# Altium project LimePSB-RPCM_1v3.PrjPcb (part 6 of 14)

## Sheet 09_USB_hub.SchDoc: USB 2.0 hub
size A3; Organization: Lime Microsystems; Address1: Surrey Tech Centre; Address2: Guildford GU2 7YG; Address3: Surrey; Address4: United Kingdom; Revision: v1.3; SheetNumber: 9; SheetTotal: 15
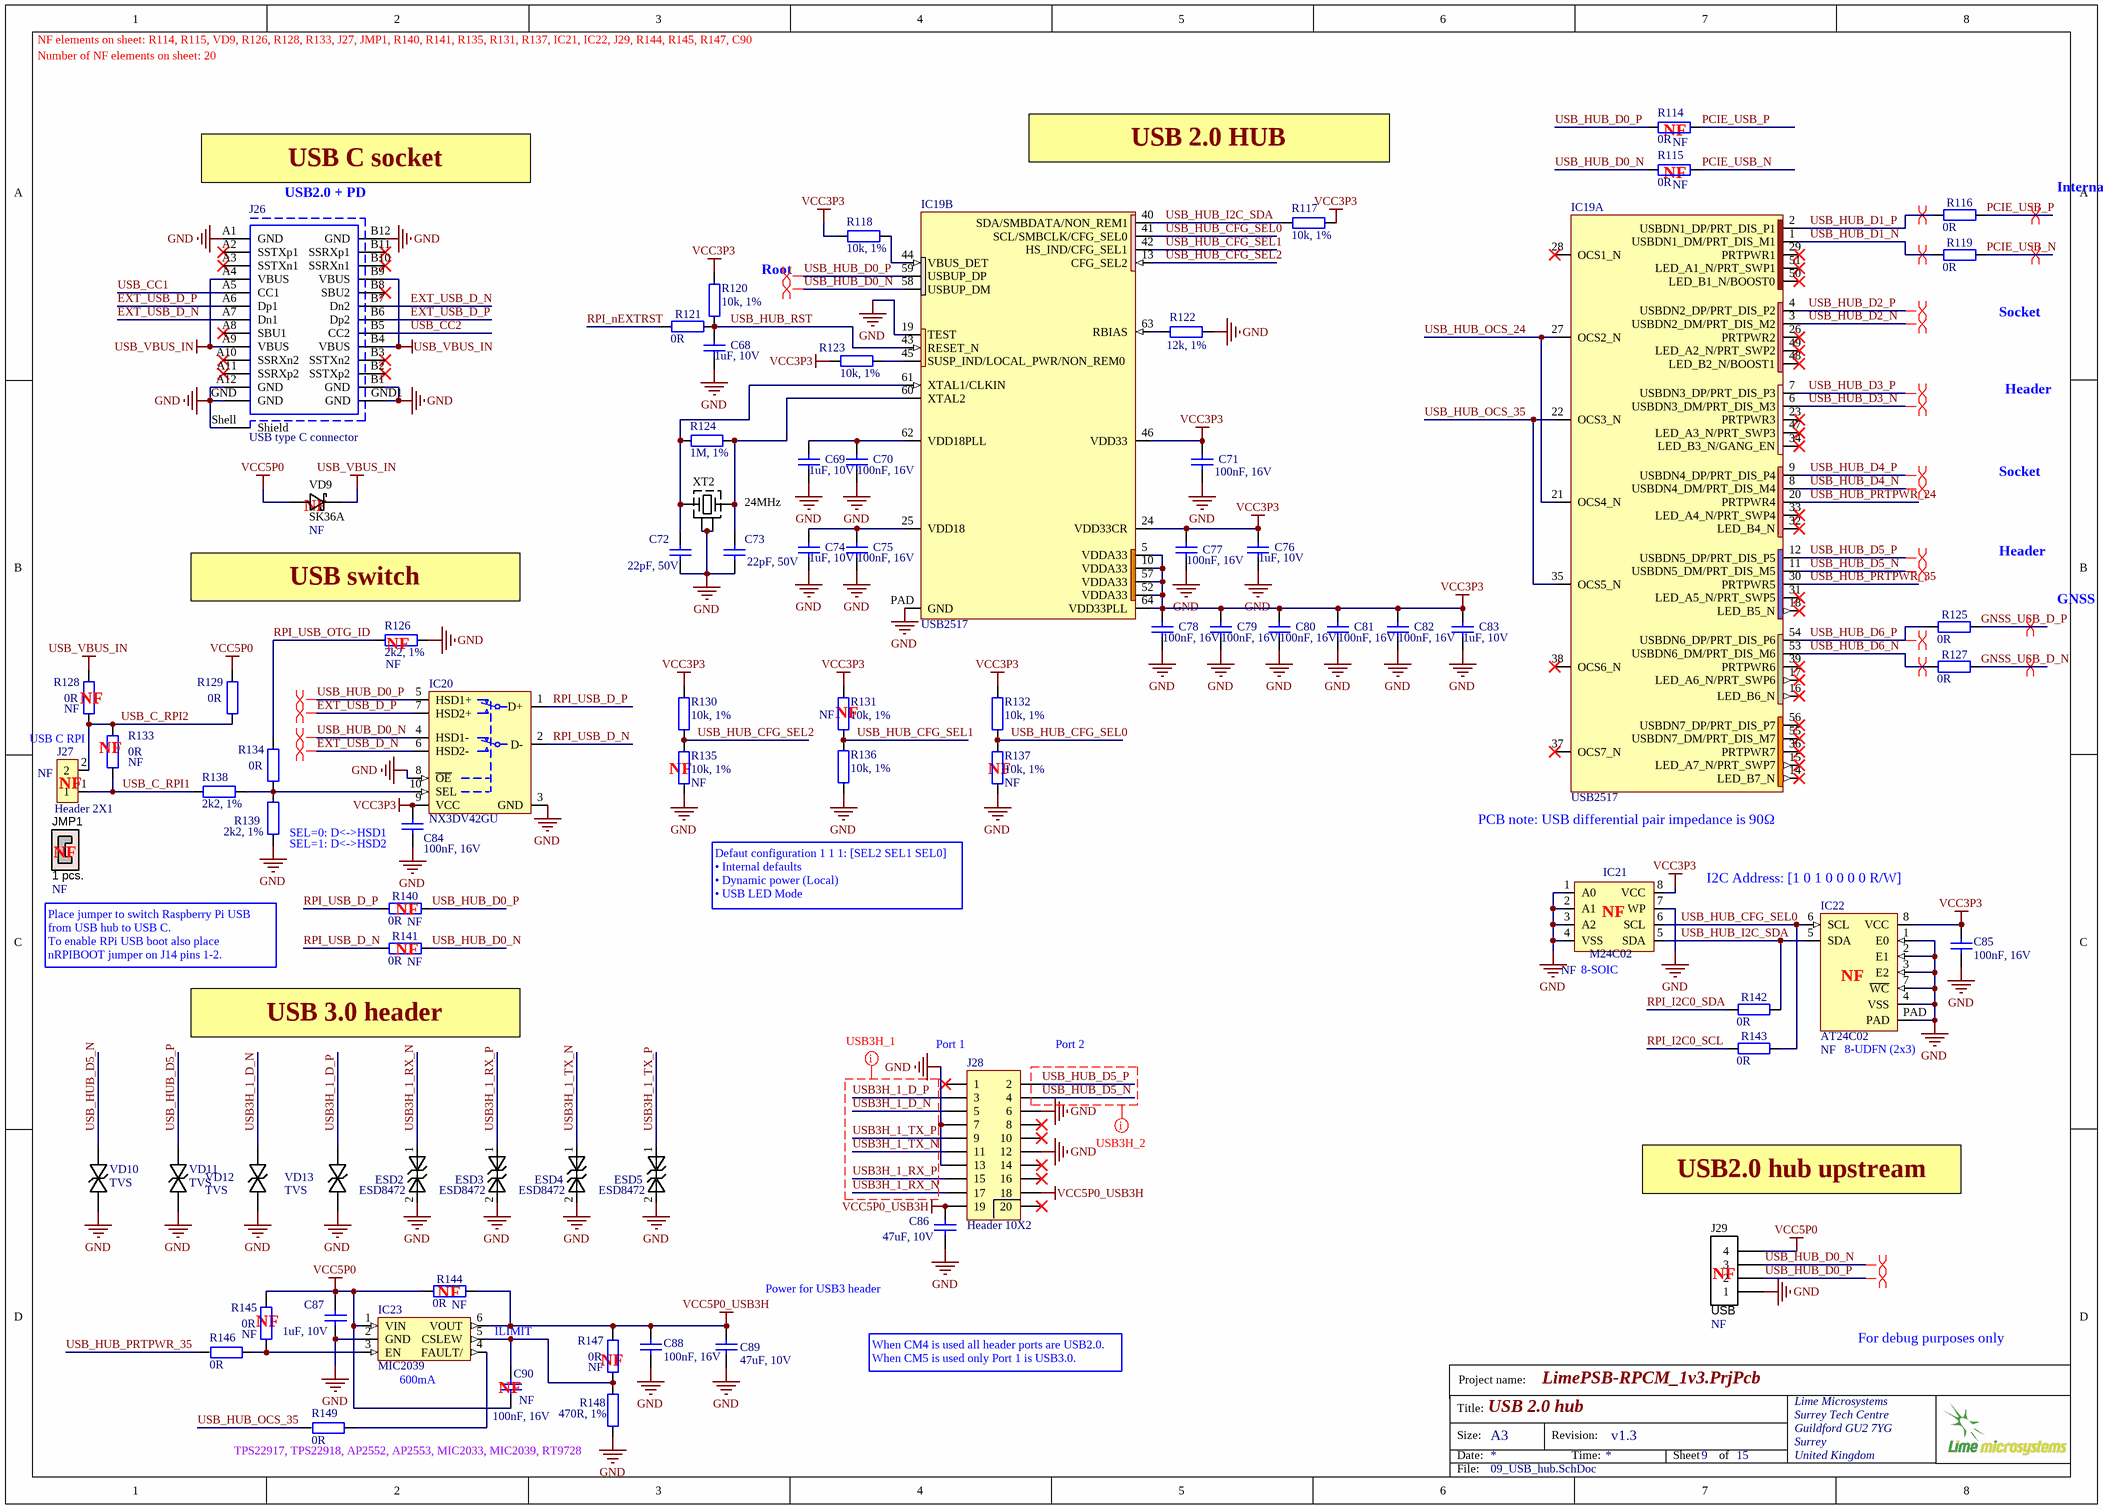
[diagram p8: 09_USB_hub.SchDoc]

### Parts
C68  1uF, 10V  [CAP0402]
C69  1uF, 10V  [CAP0402]
C70  100nF, 16V  [CAP0402]
C71  100nF, 16V  [CAP0402]
C72  22pF, 50V  [CAP0402]
C73  22pF, 50V  [CAP0402]
C74  1uF, 10V  [CAP0402]
C75  100nF, 16V  [CAP0402]
C76  1uF, 10V  [CAP0402]
C77  100nF, 16V  [CAP0402]
C78  100nF, 16V  [CAP0402]
C79  100nF, 16V  [CAP0402]
C80  100nF, 16V  [CAP0402]
C81  100nF, 16V  [CAP0402]
C82  100nF, 16V  [CAP0402]
C83  1uF, 10V  [CAP0402]
C84  100nF, 16V  [CAP0402]
C85  100nF, 16V  [CAP0402]
C86  47uF, 10V  [CAP1206]
C87  1uF, 10V  [CAP0402]
C88  100nF, 16V  [CAP0402]
C89  47uF, 10V  [CAP1206]
C90  100nF, 16V  Assembly Info: NF  [CAP0402]
ESD2  ESD8472  [ESD8472_X3DFN2]
ESD3  ESD8472  [ESD8472_X3DFN2]
ESD4  ESD8472  [ESD8472_X3DFN2]
ESD5  ESD8472  [ESD8472_X3DFN2]
IC19  USB2517  [USB2517-JZX-TR_USB_HUB_QFN64]  (parts A,B of 2)
IC20  NX3DV42GU  [FSUSB42UMX]
IC21  M24C02  Assembly Info: NF  [SOIC127P600-8DL_v2]
IC22  AT24C02  Assembly Info: NF  [M24128-DFMC6TG]
IC23  MIC2039  [SOT23-6]
J26  USB type C connector  [DUAL_USB-C_632723100011]
J27  Header 2X1  Assembly Info: NF  [HDR_1x2]
J28  Header 10X2  [Header10x2_TH_2MM]
J29  USB  Assembly Info: NF  [HEADER4X1_TH]
JMP1  1 pcs.  Assembly Info: NF  (mechanical)
R114  0R  Assembly Info: NF  [RES0402]
R115  0R  Assembly Info: NF  [RES0402]
R116  0R  [RES0402]
R117  10k, 1%  [RES0402]
R118  10k, 1%  [RES0402]
R119  0R  [RES0402]
R120  10k, 1%  [RES0402]
R121  0R  [RES0402]
R122  12k, 1%  [RES0402]
R123  10k, 1%  [RES0402]
R124  1M, 1%  [RES0402]
R125  0R  [RES0402]
R126  2k2, 1%  Assembly Info: NF  [RES0402]
R127  0R  [RES0402]
R128  0R  Assembly Info: NF  [RES0402]
R129  0R  [RES0402]
R130  10k, 1%  [RES0402]
R131  10k, 1%  Assembly Info: NF  [RES0402]
R132  10k, 1%  [RES0402]
R133  0R  Assembly Info: NF  [RES0402]
R134  0R  [RES0402]
R135  10k, 1%  Assembly Info: NF  [RES0402]
R136  10k, 1%  [RES0402]
R137  10k, 1%  Assembly Info: NF  [RES0402]
R138  2k2, 1%  [RES0402]
R139  2k2, 1%  [RES0402]
R140  0R  Assembly Info: NF  [RES0402]
R141  0R  Assembly Info: NF  [RES0402]
R142  0R  [RES0402]
R143  0R  [RES0402]
R144  0R  Assembly Info: NF  [RES0402]
R145  0R  Assembly Info: NF  [RES0402]
R146  0R  [RES0402]
R147  0R  Assembly Info: NF  [RES0402]
R148  470R, 1%  [RES0402]
R149  0R  [RES0402]
VD9  SK36A  Assembly Info: NF  [SK32A-L_DIODE_DO-214AC]
VD10  TVS  [SOD323]
VD11  TVS  [SOD323]
VD12  TVS  [SOD323]
VD13  TVS  [SOD323]
XT2  24MHz  [CRYSTAL_4-LCC]

### Nets
GND: C68.1 C69.1 C70.2 C71.2 C72.1 C73.1 C74.1 C75.2 C76.1 C77.2 C78.2 C79.2 C80.2 C81.2 C82.2 C83.1 C84.2 C85.2 C86.1 C87.2 C88.2 C89.1 ESD2.2 ESD3.2 ESD4.2 ESD5.2 IC19.19(TEST) IC19.PAD(GND) IC20.3(GND) IC20.8(~{OE}) IC21.1(A0) IC21.2(A1) IC21.3(A2) IC21.4(VSS) IC21.7(WP) IC22.1(E0) IC22.2(E1) IC22.3(E2) IC22.4(VSS) IC22.7(~{WC}) IC22.PAD IC23.2(GND) J26.A1(GND) J26.A12(GND) J26.B1(GND) J26.B12(GND) J26.GND J26.GND1(GND) J26.Shell(Shield) J28.6 J28.7 J28.12 J28.13 J29.1 R122.2 R126.2 R135.1 R136.2 R137.1 R139.2 R148.1 VD10.K VD11.K VD12.K VD13.K XT2.2(GND) XT2.4(GND)
USB_VBUS_IN: J26.A4(VBUS) J26.A9(VBUS) J26.B4(VBUS) J26.B9(VBUS) R128.2 VD9.K
VCC3P3: C71.1 C76.2 C77.1 C78.1 C79.1 C80.1 C81.1 C82.1 C83.2 C84.1 C85.1 IC19.5(VDDA33) IC19.10(VDDA33) IC19.24(VDD33CR) IC19.46(VDD33) IC19.52(VDDA33) IC19.57(VDDA33) IC19.64(VDD33PLL) IC20.9(VCC) IC21.8(VCC) IC22.8(VCC) R117.2 R118.1 R120.2 R123.2 R130.2 R131.2 R132.2
VCC5P0: C87.1 C90.2 IC23.1(VIN) J29.4 R129.2 R144.2 R145.2 VD9.A
VCC5P0_USB3H: C86.2 C88.1 C89.2 IC23.6(VOUT) J28.18 J28.19 R144.1 R147.2
EXT_USB_D_N: IC20.6(HSD2-) J26.A7(Dn1) J26.B7(Dn2)
EXT_USB_D_P: IC20.7(HSD2+) J26.A6(Dp1) J26.B6(Dp2)
GNSS_USB_D_N: R127.1
GNSS_USB_D_P: R125.1
PCIE_USB_N: R115.2 R119.1
PCIE_USB_P: R114.2 R116.1
RPI_I2C0_SCL: R143.2
RPI_I2C0_SDA: R142.2
RPI_nEXTRST: R121.2
RPI_USB_D_N: IC20.2(D-) R141.2
RPI_USB_D_P: IC20.1(D+) R140.2
RPI_USB_OTG_ID: R126.1 R134.2
USB3H_1_D_N: J28.5 VD12.A
USB3H_1_D_P: J28.3 VD13.A
USB3H_1_RX_N: ESD2.1 J28.17
USB3H_1_RX_P: ESD3.1 J28.15
USB3H_1_TX_N: ESD4.1 J28.11
USB3H_1_TX_P: ESD5.1 J28.9
USB_C_RPI1: J27.1 R133.1 R138.1
USB_C_RPI2: J27.2 R128.1 R129.1 R133.2
USB_CC1: J26.A5(CC1)
USB_CC2: J26.B5(CC2)
USB_HUB_CFG_SEL0: IC19.41(SCL/SMBCLK/CFG_SEL0) IC21.6(SCL) IC22.6(SCL) R132.1 R137.2 R143.1
USB_HUB_CFG_SEL1: IC19.42(HS_IND/CFG_SEL1) R131.1 R136.1
USB_HUB_CFG_SEL2: IC19.13(CFG_SEL2) R130.1 R135.2
USB_HUB_D0_N: IC19.58(USBUP_DM) IC20.4(HSD1-) J29.3 R115.1 R141.1
USB_HUB_D0_P: IC19.59(USBUP_DP) IC20.5(HSD1+) J29.2 R114.1 R140.1
USB_HUB_D1_N: IC19.1(USBDN1_DM/PRT_DIS_M1) R119.2
USB_HUB_D1_P: IC19.2(USBDN1_DP/PRT_DIS_P1) R116.2
USB_HUB_D2_N: IC19.3(USBDN2_DM/PRT_DIS_M2)
USB_HUB_D2_P: IC19.4(USBDN2_DP/PRT_DIS_P2)
USB_HUB_D3_N: IC19.6(USBDN3_DM/PRT_DIS_M3)
USB_HUB_D3_P: IC19.7(USBDN3_DP/PRT_DIS_P3)
USB_HUB_D4_N: IC19.8(USBDN4_DM/PRT_DIS_M4)
USB_HUB_D4_P: IC19.9(USBDN4_DP/PRT_DIS_P4)
USB_HUB_D5_N: IC19.11(USBDN5_DM/PRT_DIS_M5) J28.4 VD10.A
USB_HUB_D5_P: IC19.12(USBDN5_DP/PRT_DIS_P5) J28.2 VD11.A
USB_HUB_D6_N: IC19.53(USBDN6_DM/PRT_DIS_M6) R127.2
USB_HUB_D6_P: IC19.54(USBDN6_DP/PRT_DIS_P6) R125.2
USB_HUB_I2C_SDA: IC19.40(SDA/SMBDATA/NON_REM1) IC21.5(SDA) IC22.5(SDA) R117.1 R142.1
USB_HUB_OCS_24: IC19.21(OCS4_N) IC19.27(OCS2_N)
USB_HUB_OCS_35: IC19.22(OCS3_N) IC19.35(OCS5_N) R149.2
USB_HUB_PRTPWR_24: IC19.20(PRTPWR4)
USB_HUB_PRTPWR_35: IC19.30(PRTPWR5) R146.2
USB_HUB_RST: C68.2 IC19.43(RESET_N) R120.1 R121.1
NetC69_2: C69.2 C70.1 IC19.62(VDD18PLL)
NetC72_2: C72.2 IC19.61(XTAL1/CLKIN) R124.1 XT2.1(X)
NetC73_2: C73.2 IC19.60(XTAL2) R124.2 XT2.3(X)
NetC74_2: C74.2 C75.1 IC19.25(VDD18)
NetC90_1: C90.1 IC23.5(CSLEW) R147.1 R148.2
NetIC19_44: IC19.44(VBUS_DET) R118.2
NetIC19_45: IC19.45(SUSP_IND/LOCAL_PWR/NON_REM0) R123.1
NetIC19_63: IC19.63(RBIAS) R122.1
NetIC20_10: IC20.10(SEL) R134.1 R138.2 R139.1
NetIC23_3: IC23.3(EN) R145.1 R146.1
NetIC23_4: IC23.4(FAULT/) R149.1

Not connected (* = marked no-connect by the designer): IC19 14(LED_B7_N)* 15(LED_A7_N/PRT_SWP7)* 16(LED_B6_N)* 17(LED_A6_N/PRT_SWP6)* 18(LED_B5_N)* 23(PRTPWR3)* 26(PRTPWR2)* 28(OCS1_N)* 29(PRTPWR1)* 31(LED_A5_N/PRT_SWP5)* 32(LED_B4_N)* 33(LED_A4_N/PRT_SWP4)* 34(LED_B3_N/GANG_EN)* 36(PRTPWR7)* 37(OCS7_N)* 38(OCS6_N)* 39(PRTPWR6)* 47(LED_A3_N/PRT_SWP3)* 48(LED_B2_N/BOOST1)* 49(LED_A2_N/PRT_SWP2)* 50(LED_B1_N/BOOST0)* 51(LED_A1_N/PRT_SWP1)* 55(USBDN7_DM/PRT_DIS_M7)* 56(USBDN7_DP/PRT_DIS_P7)*; J26 A2(SSTXp1)* A3(SSTXn1)* A8(SBU1)* A10(SSRXn2)* A11(SSRXp2)* B2(SSTXp2)* B3(SSTXn2)* B8(SBU2)* B10(SSRXn1)* B11(SSRXp1)*; J28 1* 8* 10* 14* 16* 20*; JMP1 1 2

### Layout directives
differential pair: EXT_USB_D_N, EXT_USB_D_P, GNSS_USB_D_N, GNSS_USB_D_P, PCIE_USB_N, PCIE_USB_P, USB_HUB_D0_N, USB_HUB_D0_P, USB_HUB_D1_N, USB_HUB_D1_P, USB_HUB_D2_N, USB_HUB_D2_P, USB_HUB_D3_N, USB_HUB_D3_P, USB_HUB_D4_N, USB_HUB_D4_P, USB_HUB_D5_N, USB_HUB_D5_P, USB_HUB_D6_N, USB_HUB_D6_P
net class USB3H_2: USB_HUB_D5_N, USB_HUB_D5_P
net class USB3H_1: USB3H_1_D_N, USB3H_1_D_P, USB3H_1_RX_N, USB3H_1_RX_P, USB3H_1_TX_N, USB3H_1_TX_P

### Notes on the sheet
- NF elements on sheet: R114, R115, VD9, R126, R128, R133, J27, JMP1, R140, R141, R135, R131, R137, IC21, IC22, J29, R144, R145, R147, C90
- Number of NF elements on sheet: 20
- USB C socket
- USB 2.0 HUB
- (near R115) NF
- (near R114) NF
- (near J26) USB2.0 + PD
- (near R116) Internal (mPCIe)
- Root
- (near R119) Socket
- Header
- (near VD9) NF
- Socket
- USB switch
- (near R126) NF
- GNSS
- (near R128) NF
- (near R131) NF
- USB C RPI
- (near J27) NF
- (near R133) NF
- (near R135) NF
- (near R137) NF
- (near JMP1) NF
- (near R139) SEL=0: D<->HSD1
- (near R139) SEL=1: D<->HSD2
- (near IC19) PCB note: USB differential pair impedance is 90Ω
- (near R140) NF
- Defaut configuration 1 1 1: [SEL2 SEL1 SEL0]
  • Internal defaults
  • Dynamic power (Local)
  • USB LED Mode
- (near IC21) NF
- I2C Address: [1 0 1 0 0 0 0 R/W]
- Place jumper to switch Raspberry Pi USB from USB hub to USB C.
  To enable RPi USB boot also place nRPIBOOT jumper on J14 pins 1-2.
- (near R141) NF
- (near IC21) 8-SOIC
- (near IC22) NF
- (near R141) USB 3.0 header
- (near J28) Port 1
- (near J28) Port 2
- (near IC22) 8-UDFN (2x3)
- USB2.0 hub upstream
- (near R145) NF
- (near R144) NF
- Power for USB3 header
- (near J29) NF
- (near IC23) 600mA
- (near C90) NF
- (near IC23) ILIMIT
- (near R147) NF
- When CM4 is used all header ports are USB2.0.
  When CM5 is used only Port 1 is USB3.0.
- (near J29) For debug purposes only
- TPS22917, TPS22918, AP2552, AP2553, MIC2033, MIC2039, RT9728
- Project name:
- Title:
- Size:
- Date:
- A3
- Revision:
- Time:
- Sheet
- of
- File:

### Library data of the parts
C68 C69 C74 C76 C83 = Cap_0402: as C30 on sheet 07_Misc_2; Value: 1uF, 10V; Supplier 1: Digi-Key; Supplier Part Number 1: 311-1732-1-ND; RoHS: RoHS Compliant; Applications: General Purpose; Category: Capacitors; ComponentLink1Description: http://www.yageo.com/documents/recent/UPY-GPHC_X5R_4V-to-50V_25.pdf; ComponentLink1URL: http://www.yageo.com/documents/recent/UPY-GPHC_X5R_4V-to-50V_25.pdf; Failure Rate: -; Features: -; Height - Seated (Max): -; Lead Spacing: -; Lead Style: -; Mounting Type: Surface Mount, MLCC; Operating Temperature: -55°C ~ 85°C; Package / Case: 0402 (1005 Metric); Packaging: Cut Tape (CT); Part Status: Active; Pricing 1: 1=0.22, 10=0.156, 100=0.0732, 500=0.0513, 1000=0.04248, 2500=0.03953, 5000=0.03617 (USD); Ratings: -; Size / Dimension: 0.039" L x 0.020" W (1.00mm x 0.50mm); Stock 1: 69600; Temperature Coefficient: X5R; Thickness (Max): 0.022" (0.55mm); Voltage - Rated: 10V
C70 C71 C75 C77-C82 C84 = Cap_0402: as C35 on sheet 07_Misc_2; Value: 100nF, 16V; Supplier 1: Mouser; Supplier Part Number 1: 81-GRM155R71C104KA88; Case Code - in: 0402; RoHS: RoHS Compliant; Operating Temperature Range: - 55 C to + 125 C; Series: GRM; Termination Style: SMD/SMT; Package / Case: 0402 (1005 metric); Voltage Rating DC: 16 V; Maximum Operating Temperature: + 125 C; Case Code - mm: 1005; Minimum Operating Temperature: - 55 C; Product Category: Low & Medium Capacitance SMD Ceramic Chip Capacitors; Packaging: Reel; Product: General Type MLCCs; Category: Multilayer Ceramic Capacitors MLCC - SMD/SMT; Brand: Murata Electronics; Case Width: 0.5 mm; RoHS - Mouser: Y; Standard Pack Qty: 10000; Minimum Order Quantity: 1; Reeling: True; Manufacturer Part Number 1: GRM155R71C104KA88D
C72 C73 = Cap_0402: Manufacturer: Yageo; Manufacturer Part Number 1: CC0402JRNPO9BN220; Part Description: 22pF ±5% 50V C0G, NP0 Ceramic Capacitor -55°C ~ 125°C Surface Mount, MLCC 0402 (1005 Metric) 0.039" L x 0.020" W (1.00mm x 0.50mm); Tolerance: ±5%; Temperature Coefficient: C0G, NP0; Value: 22pF, 50V; Supplier 1: Digi-Key; Supplier Part Number 1: 311-1018-2-ND; Category: Capacitors; Voltage - Rated: 50V; Packaging: Tape & Reel (TR); RoHS: RoHS Compliant; Capacitance: 22pF; Operating Temperature: -55°C ~ 125°C; Mounting Type: Surface Mount, MLCC; Height - Seated (Max): -; Size / Dimension: 0.039" L x 0.020" W (1.00mm x 0.50mm); Ratings: -; Applications: General Purpose; Thickness (Max): 0.022" (0.55mm); Lead Spacing: -; Lead Style: -; Features: -; Package / Case: 0402 (1005 Metric)
C85 = Cap_0603: as C29 on sheet 07_Misc_2; Supplier 1: Mouser; Supplier Part Number 1: 81-GRM155R71C104KA88; Case Code - in: 0402; Manufacturer: Murata Electronics; Category: Multilayer Ceramic Capacitors MLCC - SMD/SMT; Voltage Rating DC: 16 V; Value: 100nF, 16V; Manufacturer Part Number: GRM155R71C104KA88D; Case Code - mm: 1005; Case Width: 0.5 mm; Maximum Operating Temperature: + 125 C; Minimum Operating Temperature: - 55 C; Minimum Order Quantity: 1; Operating Temperature Range: - 55 C to + 125 C; Package / Case: 0402 (1005 metric); Packaging: Reel; Product: General Type MLCCs; Product Category: Low & Medium Capacitance SMD Ceramic Chip Capacitors; Reeling: True; RoHS - Mouser: Y; RoHS: RoHS Compliant; Series: GRM; Standard Pack Qty: 10000; Termination Style: SMD/SMT
C86 C89 = Cap_1206: Manufacturer: TDK Corporation; Manufacturer Part Number 1: C3216X6S1A476M160AC; Part Description: 47µF ±20% 10V Ceramic Capacitor X6S 1206 (3216 Metric); Notification: Current market demand for these product types have resulted in fluctuating and extending lead times. Lead times may differ.; Tolerance: ±20%; Temperature Coefficient: X6S; Value: 47uF, 10V; RoHS: RoHS Compliant; Packaging: Cut Tape (CT); Operating Temperature: -55°C ~ 105°C; Voltage - Rated: 10V; Height - Seated (Max): -; Ratings: -; Applications: General Purpose; Features: Low ESL; Size / Dimension: 0.126" L x 0.063" W (3.20mm x 1.60mm); Supplier 1: Digi-Key; Lead Spacing: -; Supplier Part Number 1: 445-6010-1-ND; Thickness (Max): 0.071" (1.80mm); Failure Rate: -; Category: Capacitors; Lead Style: -; Part Status: Active; Mounting Type: Surface Mount, MLCC; Package / Case: 1206 (3216 Metric)
C87 = Cap_0402: as C34 on sheet 07_Misc_2; Value: 1uF, 10V; Supplier 1: Digi-Key; Supplier Part Number 1: 311-1732-1-ND; MSL: -; RoHS: YES
C88 C90 = Cap_0402: Manufacturer: Murata Electronics; Manufacturer Part Number 1: GRM155R71C104KA88D; Part Description: 0.10µF ±10% 16V Ceramic Capacitor X7R 0402 (1005 Metric); Tolerance: 10 %; Type: General Purpose MLCC; Capacitance: 0.1 uF; Case Length: 1 mm; Dielectric: X7R; Case Height: 0.5 mm; Temperature Coefficient / Code: +/- 15 %; Value: 100nF, 16V; Supplier 1: Mouser; Supplier Part Number 1: 81-GRM155R71C104KA88; Case Code - in: 0402; RoHS: RoHS Compliant; Operating Temperature Range: - 55 C to + 125 C; Series: GRM; Termination Style: SMD/SMT; Package / Case: 0402 (1005 metric); Voltage Rating DC: 16 V; Maximum Operating Temperature: + 125 C; Case Code - mm: 1005; Minimum Operating Temperature: - 55 C; Product Category: Low & Medium Capacitance SMD Ceramic Chip Capacitors; Packaging: Reel; Product: General Type MLCCs; Category: Multilayer Ceramic Capacitors MLCC - SMD/SMT; Brand: Murata Electronics; Case Width: 0.5 mm; RoHS - Mouser: Y; Standard Pack Qty: 10000; Minimum Order Quantity: 1; Reeling: True; Manufacturer Part Number: GRM155R71C104KA88D
ESD2-ESD5 = ESD8472: as ESD1 on sheet 07_Misc_2; Supplier 1: Digi-Key; RoHS: RoHS Compliant; Category: Circuit Protection; Stock 1: 2295; Pricing 1: 1=0.39, 10=0.315, 100=0.2142, 500=0.16068, 1000=0.12051 (USD); Packaging: Cut Tape (CT); Part Status: Active; Type: Zener; Power - Peak Pulse: -; Applications: Automotive, RF Antenna; Operating Temperature: -55°C ~ 150°C (TJ); Mounting Type: Surface Mount; Package / Case: 2-XFDFN; Supplier Device Package: 2-X3DFN (0.62x0.32); ComponentLink1URL: http://www.onsemi.com/pub/Collateral/ESD8472-D.PDF; ComponentLink1Description: http://www.onsemi.com/pub/Collateral/ESD8472-D.PDF; Supplier Part Number 1: ESD8472MUT5GOSCT-ND
IC19 = USB2517-JZX-TR_USB_HUB: Part Description: USB Hub Controller USB 2.0 USB Interface 64-QFN (9x9); Manufacturer: Microchip; Interface: USB; Operating Supply Current: 130mA; Supplier 1: Digi-Key; Supplier Part Number 1: USB2517-JZX-CT-ND; Manufacturer Part Number 1: USB2517-JZX-TR; Stock 1: 26622; Pricing 1: 1=5,72000, 25=5,55000 (USD); RoHS: Yes; Min Operating Temperature: 0°C; Max Operating Temperature: 70°C; Package Quantity: 3000; Packaging: Tape and Reel; Lead Free: Lead Free; RoHS Compliant: Yes; ComponentLink1URL: https://datasheet.ciiva.com/29644/2517-29644802.pdf?src-supplier=Digi-Key; ComponentLink1Description: https://datasheet.ciiva.com/29644/2517-29644802.pdf?src-supplier=Digi-Key
IC20 = FSUSB42UMX: Part Description: USB Switch IC 1 Channel 10-UMLP (1.8x1.4); Manufacturer: NXP Semiconductors; Manufacturer Part Number 1: NX3DV42GU,115; ComponentLink1URL: https://www.fairchildsemi.com/datasheets/FS/FSUSB42.pdf; ComponentLink1Description: https://www.fairchildsemi.com/datasheets/FS/FSUSB42.pdf; Supplier 1: Digikey; Supplier Part Number 1: 568-12388-1-ND; Stock 1: 3109; Pricing 1: 1=0,89, 10=0,781, 25=0,7336, 100=0,5987, 250=0,55612, 500=0,47328, 1000=0,37863 (USD); RoHS: Yes; ComponentLink2URL: http://www.mouser.com/ds/2/302/NX3DV42-1127466.pdf?src-supplier=Mouser; ComponentLink2Description: http://www.mouser.com/ds/2/302/NX3DV42-1127466.pdf?src-supplier=Mouser; ComponentLink3URL: http://www.nxp.com/documents/data_sheet/NX3DV42.pdf?src-supplier=Avnet; ComponentLink3Description: http://www.nxp.com/documents/data_sheet/NX3DV42.pdf?src-supplier=Avnet; ComponentLink4URL: http://www.nxp.com/documents/data_sheet/NX3DV42.pdf?src-supplier=Digikey; ComponentLink4Description: http://www.nxp.com/documents/data_sheet/NX3DV42.pdf?src-supplier=Digikey; ComponentLink5URL: https://www.nxp.com/docs/en/data-sheet/NX3DV42.pdf?src-supplier=Digikey; ComponentLink5Description: https://www.nxp.com/docs/en/data-sheet/NX3DV42.pdf?src-supplier=Digikey
IC21 = 24FC64F: Part Description: IC EEPROM 2KBIT I2C 400KHZ 8SOIC; Manufacturer: STMicroelectronics; Manufacturer Part Number 1: M24C02-RMN6TP; Max Supply Voltage: 5.5V; Min Supply Voltage: 1.8V; Interface: I2C,Serial,2-Wire; Access Time: 900ns; Frequency: 400kHz; Nominal Supply Current: 800uA; Density: 2Kb; Memory Type: EEPROM; Organization: 256X8; Write Protection: YES; Write Cycle Time-Max (tWC): 5ms; ComponentLink1URL: http://www.onsemi.com/pub/Collateral/CAT24C128-D.PDF; ComponentLink1Description: http://www.onsemi.com/pub/Collateral/CAT24C128-D.PDF; Supplier 1: Digi-Key; Supplier Part Number 1: 497-8633-1-ND; Stock 1: 84403; Pricing 1: 1=0,17000, 10=0,16400, 25=0,15200, 50=0,15140, 100=0,13440, 250=0,13272, 500=0,13070, 1000=0,12721 (USD); RoHS: Yes; Mount: Surface Mount; Case/Package: SOIC; Number of Pins: 8; Contact Plating: Gold; Min Operating Temperature: -40°C; Max Operating Temperature: 85°C; Packaging: Tape and Reel; Package Quantity: 1; Memory Size: 2Kb; Max Frequency: 400kHz; Series: -; Programming Voltage: 5.5V; Access Time-Max: 900ns; Supply Current: 800uA; Supply Voltage-Nom: 5.5V; Length: 4.9mm; Width: 3.9mm; Height: 1.25mm; Radiation Hardening: No; Reach SVHC Compliant: Yes; Lead Free: Lead Free; RoHS Compliant: Yes; ComponentLink2URL: https://datasheet.ciiva.com/41455/001186000-da-01-en-ic-eeprom-2kbit-m24c02-rmn6tp-soic-8-stm-41455162.pdf?src-supplier=Conrad; ComponentLink2Description: https://datasheet.ciiva.com/41455/001186000-da-01-en-ic-eeprom-2kbit-m24c02-rmn6tp-soic-8-stm-41455162.pdf?src-supplier=Conrad
IC22 = M24128-DFMC6TG: Part Description: IC EEPROM 2KBIT I2C 1MHZ 8UDFN; Manufacturer: Microchip; Manufacturer Part Number 1: AT24C02C-MAHM-E; ComponentLink1URL: http://www.st.com/content/ccc/resource/technical/document/datasheet/59/05/c9/5b/7b/41/48/b6/CD00259167.pdf/files/CD00259167.pdf/jcr:content/translations/en.CD00259167.pdf; ComponentLink1Description: http://www.st.com/content/ccc/resource/technical/document/datasheet/59/05/c9/5b/7b/41/48/b6/CD00259167.pdf/files/CD00259167.pdf/jcr:content/translations/en.CD00259167.pdf; Supplier 1: Digi-Key; Supplier Part Number 1: AT24C02C-MAHM-ECT-ND; Stock 1: 14438; Pricing 1: 1=0,28000 (USD); RoHS: No; RoHS Compliant: No; ComponentLink2URL: http://www.microchip.com/mymicrochip/filehandler.aspx?ddocname=en590438&src-supplier=Digi-Key; ComponentLink2Description: http://www.microchip.com/mymicrochip/filehandler.aspx?ddocname=en590438&src-supplier=Digi-Key
IC23 = MIC2033_power_switch: Part Description: Power Switch/Driver 1:1 P-Channel 2.5A SOT-23-6; Manufacturer: Microchip; Manufacturer Part Number 1: MIC2039EYM6-TR; Number of Outputs: 1; Interface: On/Off; Max Output Current: 2.5A; Fault Protection: Over Temperature; Output Configuration: High Side; ComponentLink1URL: http://www.mouser.com/ds/2/268/mic2033-b-1076865.pdf?src-supplier=Mouser; ComponentLink1Description: http://www.mouser.com/ds/2/268/mic2033-b-1076865.pdf?src-supplier=Mouser; ComponentLink2URL: http://components.arrow.com/part/dataview/56727820S413982N1374?src-supplier=Arrow+Electronics; ComponentLink2Description: http://components.arrow.com/part/dataview/56727820S413982N1374?src-supplier=Arrow+Electronics; ComponentLink3URL: http://www.microchip.com/mymicrochip/filehandler.aspx?ddocname=en579457&src-supplier=Digi-Key; ComponentLink3Description: http://www.microchip.com/mymicrochip/filehandler.aspx?ddocname=en579457&src-supplier=Digi-Key; Supplier 1: Digi-Key; Supplier Part Number 1: 576-4193-1-ND; Stock 1: 37195; Pricing 1: 1=0,98000, 25=0,80560, 100=0,75000 (USD); RoHS: No; Case/Package: SOT-23-6; Min Operating Temperature: -40°C; Max Operating Temperature: 125°C; Package Quantity: 3000; Packaging: Tape and Reel; Series: -; ComponentLink4URL: https://datasheet.ciiva.com/6607/mic2039-6607725.pdf?src-supplier=Digi-Key; ComponentLink4Description: https://datasheet.ciiva.com/6607/mic2039-6607725.pdf?src-supplier=Digi-Key
J26 = DUAL_USB-C_632723100011: Manufacturer: Wurth Electronics; Part Description: USB - C (Type - C) USB 3.1 (USB 3.1 Gen 2, Superspeed+) Receptacle Connector 24 Position Surface Mount, Right Angle; Through Hole; Number of Contacts: 24; Gender: Receptacle; ComponentLink1URL: http://www.alliedelec.com/m/d/e03b7b5d71e2d3e369c52d5c8eaca2b6.pdf?src-supplier=Allied+Electronics; ComponentLink1Description: http://www.alliedelec.com/m/d/e03b7b5d71e2d3e369c52d5c8eaca2b6.pdf?src-supplier=Allied+Electronics; ComponentLink2URL: http://www.jae.com/z-en/pdf_download_exec.cfm?param=SJ115995.pdf&src-supplier=Digi-Key; ComponentLink2Description: http://www.jae.com/z-en/pdf_download_exec.cfm?param=SJ115995.pdf&src-supplier=Digi-Key; Supplier 1: Digi-Key; Supplier Part Number 1: 732-9617-1-ND; Manufacturer Part Number 1: 632723100011; Stock 1: 1127; Pricing 1: 1=4,10000, 10=3,80000, 50=3,20000, 100=2,95000 (USD); RoHS: Yes; Mount: Surface Mount,Through Hole; Packaging: Tape and Reel; Connector Type: USB; ComponentLink3URL: https://www.mouser.com/ds/2/445/632723x00011-782157.pdf?src-supplier=Mouser; ComponentLink3Description: https://www.mouser.com/ds/2/445/632723x00011-782157.pdf?src-supplier=Mouser; ComponentLink4URL: https://katalog.we-online.de/em/datasheet/632723x00011.pdf?src-supplier=Digi-Key; ComponentLink4Description: https://katalog.we-online.de/em/datasheet/632723x00011.pdf?src-supplier=Digi-Key
J27 = Jumper: as J18 on sheet 07_Misc_2; Supplier 1: Digi-Key; Supplier Part Number 1: 3M9447-ND; Contact Type: Male Pin; Color: Black; Mounting Type: Through Hole; Category: Connectors, Interconnects; Contact Finish: Gold
J28 = Header 10X2: Header, 10-Pin, Dual row; Part Description: Connector Header Through Hole 20 position 0.079" (2.00mm). 19 pins loaded (pin 20 void); Manufacturer: Molex; Manufacturer Part Number 1: 87831-5920; Supplier 1: Mouser; Supplier Part Number 1: 538-87831-5920; Stock 1: 4168; Pricing 1: 1=2,22, 10=1,98, 50=1,98, 100=1,74, 1000=1,49, 10000=1,35 (USD); RoHS: Yes
J29 = Header4P: Header, 4-pin; Part Description: 4 Positions Header Connector 0.100" (2.54mm) Through Hole Gold; Manufacturer: Wurth Electronics Inc.; Manufacturer Part Number 1: 61300411121; Pitch - Mating: 0.100" (2.54mm); Number of Positions: 4; Number of Positions Loaded: All; Style: Board to Board or Cable; Shrouding: Unshrouded; Contact Length - Mating: 0.236" (6.00mm); Contact Length - Post: 0.118" (3.00mm); Overall Contact Length: 0.454" (11.54mm); Material Flammability Rating: UL94 V-0; Current Rating: 3A; Voltage Rating: 250V; Supplier 1: Digi-Key; Supplier Part Number 1: 732-5317-ND; RoHS: RoHS Compliant; Category: Connectors, Interconnects; Stock 1: 25204; Pricing 1: 1=0.18, 10=0.153, 25=0.1272, 50=0.106, 100=0.096, 1000=0.088 (USD); Packaging: Bulk; Part Status: Active; Connector Type: Header; Contact Type: Male Pin; Number of Rows: 1; Row Spacing - Mating: -; Mounting Type: Through Hole; Termination: Solder; Fastening Type: Push-Pull; Insulation Height: 0.100" (2.54mm); Contact Shape: Square; Contact Finish - Mating: Gold; Contact Finish Thickness - Mating: -; Contact Finish - Post: -; Contact Material: Copper Alloy; Insulation Material: Polybutylene Terephthalate (PBT); Features: -; Operating Temperature: -40°C ~ 125°C; Ingress Protection: -; Insulation Color: Black; Mated Stacking Heights: -; Contact Finish Thickness - Post: -; Applications: -; ComponentLink1URL: http://katalog.we-online.de/em/datasheet/6130xx11121.pdf; ComponentLink1Description: http://katalog.we-online.de/em/datasheet/6130xx11121.pdf
JMP1 = JUMP_2P_CONN_HEADER: Shorting Jumper, 2-position, 1.27mm pitch; Part Description: 2 (1 x 2) Position Shunt Connector Black Closed Top 0.100" (2.54mm) Gold; Manufacturer: Sullins; Manufacturer Part Number 1: SPC02SYAN; Number of Positions: 2; Pitch: 0.1inch; Supplier 1: Digi-Key; Supplier Part Number 1: S9001-ND; Stock 1: 570741; Pricing 1: 1=0.1, 10=0.059, 25=0.044, 50=0.0378, 100=0.0365, 250=0.03152, 500=0.03024, 1000=0.02646, 2500=0.02394 (USD); Colour: Black; Contact Plating: Gold; Package Quantity: 1000; Packaging: Bulk; Height: 0.256inch; Lead Free: Lead Free; ComponentLink1URL: http://www.sullinscorp.com/images/SPC02SYAN-0-3293.pdf; ComponentLink1Description: http://www.sullinscorp.com/images/SPC02SYAN-0-3293.pdf; ComponentLink2URL: https://drawings-pdf.s3.amazonaws.com/11134.pdf; ComponentLink2Description: https://drawings-pdf.s3.amazonaws.com/11134.pdf
R114-R116 R119 R121 R125 R127-R129 R133 R134 R140-R147 R149 = Res_0402: as R47 on sheet 07_Misc_2; Value: 0R; Supplier 1: Digi-Key; Supplier Part Number 1: 311-0.0JRTR-ND; Category: Resistors; Temperature Coefficient: -; Features: Moisture Resistant; Supplier Device Package: 0402; Height: 0.016" (0.40mm); Package / Case: 0402 (1005 Metric); Operating Temperature: -55°C ~ 155°C; Size / Dimension: 0.039" L x 0.020" W (1.00mm x 0.50mm); Composition: Thick Film; Packaging: Tape & Reel (TR); Number of Terminations: 2; RoHS: RoHS Compliant
R117 R118 R120 R123 R130-R132 R135-R137 = Res_0402: as R40 on sheet 07_Misc_2; Value: 10k, 1%; Supplier 1: Digi-Key; Supplier Part Number 1: 311-10.0KLRTR-ND; Resistance (Ohms): 10k; Packaging: Tape & Reel (TR); RoHS: RoHS Compliant; Package / Case: 0402 (1005 Metric); Tolerance: ±1%; Operating Temperature: -55°C ~ 155°C; Size / Dimension: 0.039" L x 0.020" W (1.00mm x 0.50mm); Number of Terminations: 2; Category: Resistors; Height: 0.016" (0.40mm); Supplier Device Package: 0402; Features: Moisture Resistant; Composition: Thick Film
R122 = Res_0402: as R72 on sheet 07_Misc_2; Value: 12k, 1%; Operating Temperature: -55°C ~ 155°C; Height - Seated (Max): 0.016" (0.40mm); Supplier 1: Digi-Key; Packaging: Cut Tape (CT); Composition: Thick Film; Tolerance: ±1%; Category: Resistors; Part Status: Active; Failure Rate: -; Supplier Device Package: 0402; Features: Moisture Resistant; Supplier Part Number 1: 1276-4122-1-ND; RoHS: RoHS Compliant; Package / Case: 0402 (1005 Metric); Size / Dimension: 0.039" L x 0.020" W (1.00mm x 0.50mm)
R124 = Res_0402: Manufacturer Part Number 1: RC0402FR-071ML; Manufacturer: Yageo; Part Description: 1 MOhms ±1% 0.063W, 1/16W Chip Resistor 0402 (1005 Metric) Moisture Resistant Thick Film; Power (Watts): 0.063W, 1/16W; Temperature Coefficient: ±100ppm/°C; Value: 1M, 1%; Package / Case: 0402 (1005 Metric); Failure Rate: -; Supplier Device Package: 0402; Tolerance: ±1%; Composition: Thick Film; Category: Resistors; Part Status: Active; Height - Seated (Max): 0.016" (0.40mm); Size / Dimension: 0.039" L x 0.020" W (1.00mm x 0.50mm); Supplier 1: Digi-Key; Operating Temperature: -55°C ~ 155°C; Supplier Part Number 1: 311-1.00MLRCT-ND; RoHS: RoHS Compliant; Features: Moisture Resistant; Packaging: Cut Tape (CT)
R126 R138 R139 = Res_0402: as R42 on sheet 07_Misc_2; Value: 2k2, 1%; Supplier 1: Digi-Key; Supplier Part Number 1: RMCF0402FT2K20CT-ND; Supplier Device Package: 0402; Package / Case: 0402 (1005 Metric); Size / Dimension: 0.039" L x 0.020" W (1.00mm x 0.50mm); Operating Temperature: -55°C ~ 155°C; Composition: Thick Film; Category: Resistors; Features: -; Height: 0.016" (0.40mm); RoHS: RoHS Compliant; Number of Terminations: 2; Packaging: Cut Tape (CT); Tolerance: ±1%
R148 = Res_0402: Manufacturer 1: Yageo; Manufacturer Part Number 1: RC0402FR-07470RL; Part Description: 470 Ohms ±1% 0.063W, 1/16W Chip Resistor 0402 (1005 Metric) Moisture Resistant Thick Film; Power Rating: 62.5mW; Temperature Coefficient: 100ppm/°C; Voltage Rating: 50V; Max Power Dissipation: 63mW; Value: 470R, 1%; Supplier 1: Digi-Key; Supplier Part Number 1: 311-470LRCT-ND; Stock 1: 1652476; Pricing 1: 1=0,10000, 10=0,01600, 100=0,00660, 1000=0,00299, 2500=0,00259, 5000=0,00214 (USD); RoHS: Yes; Case/Package: 0402; Case Code (Metric): 1005; Case Code (Imperial): 0402; Size Code: 0402; Min Operating Temperature: -55°C; Max Operating Temperature: 155°C; Packaging: Tape and Reel; Tolerance: 1%; Resistance: 470R; Number of Terminations: 2; Features: Moisture Resistant; Package Quantity: 1; Resistor Type: Thick Film; Termination: SMD/SMT; Series: RC; Resistance Tolerance: 1%; Construction: Rectangular; Length: 1mm; Width: 0.02inch; Height: 0.016inch; Depth: 0.5mm; Lead Free: Lead Free; REACH SVHC: Unknown; Military Standard: Not; RoHS Compliant: Yes; Manufacturer: Yageo
VD9 = DIODE_SCHOTTKY_SOD-523F: Diode Schottky SMD SOD-523F; Manufacturer Part Number 1: SK36A-LTP; Manufacturer: Micro Commercial Co; Part Description: DIODE SCHOTTKY 60V 3A DO214AC; Current - Reverse Leakage @ Vr: 500µA @ 60V; Speed: Fast Recovery =< 500ns, > 200mA (Io); Voltage - DC Reverse (Vr) (Max): 60V; Capacitance @ Vr, F: 250pF @ 4V, 1MHz; Voltage - Forward (Vf) (Max) @ If: 750mV @ 3A; Current - Average Rectified (Io): 3A; Supplier 1: Digi-Key; Supplier Part Number 1: SK36A-LTPMSCT-ND; Package / Case: DO-214AC, SMA; Reverse Recovery Time (trr): -; Diode Type: Schottky; Category: Discrete Semiconductor Products; Mounting Type: Surface Mount; RoHS: RoHS Compliant; Packaging: Cut Tape (CT); Operating Temperature - Junction: -50°C ~ 125°C; Supplier Device Package: DO-214AC (SMA)
VD10-VD13 = DIODE_TVS: Manufacturer 1: Sangdest Microelectronics; Manufacturer Part Number: SD03LCC; Part Description: 19V Clamp 20A (8/20µs) Ipp Tvs Diode Surface Mount SOD-323; ComponentLink1URL: https://datasheet.ciiva.com/29588/littelfuse-tvs-diode-array-sp4020-datasheet-pdf-29588193.pdf?src-supplier=Digi-Key; ComponentLink1Description: https://datasheet.ciiva.com/29588/littelfuse-tvs-diode-array-sp4020-datasheet-pdf-29588193.pdf?src-supplier=Digi-Key; ComponentLink2URL: https://datasheet.ciiva.com/24111/littelfuse-sp4020-267385-24111169.pdf?src-supplier=Mouser; ComponentLink2Description: https://datasheet.ciiva.com/24111/littelfuse-sp4020-267385-24111169.pdf?src-supplier=Mouser; Supplier 1: Digi-Key; Supplier Part Number 1: 1655-SD03LCCCT-ND; Stock 1: 8808; Pricing 1: 1=0,37000, 10=0,27300, 100=0,15460, 500=0,10240, 1000=0,07851 (USD); RoHS: No; Manufacturer: Sangdest Microelectronics; Manufacturer Part Number 1: SD03LCC
XT2 = CRYSTAL_19M2: Oscillator Crystal 25 MHz; Manufacturer: Abracon; Manufacturer Part Number 1: ABM8-24.000MHZ-D1G-T; Part Description: 24 MHz ±10ppm Crystal 18pF 50 Ohms 4-SMD, No Lead; Value: 24MHz; Supplier 1: Digi-Key; Supplier Part Number 1: 535-14395-1-ND; Stock 1: 15503; Pricing 1: 1=0,47000, 10=0,39100, 50=0,35220, 100=0,31310, 500=0,29744 (USD); RoHS: Yes; RoHS Compliant: Yes; ComponentLink1URL: https://abracon.com/Resonators/abm8.pdf?src-supplier=Digi-Key; ComponentLink1Description: https://abracon.com/Resonators/abm8.pdf?src-supplier=Digi-Key